# EAGLE design motor+line (EAGLE 9.5.1)
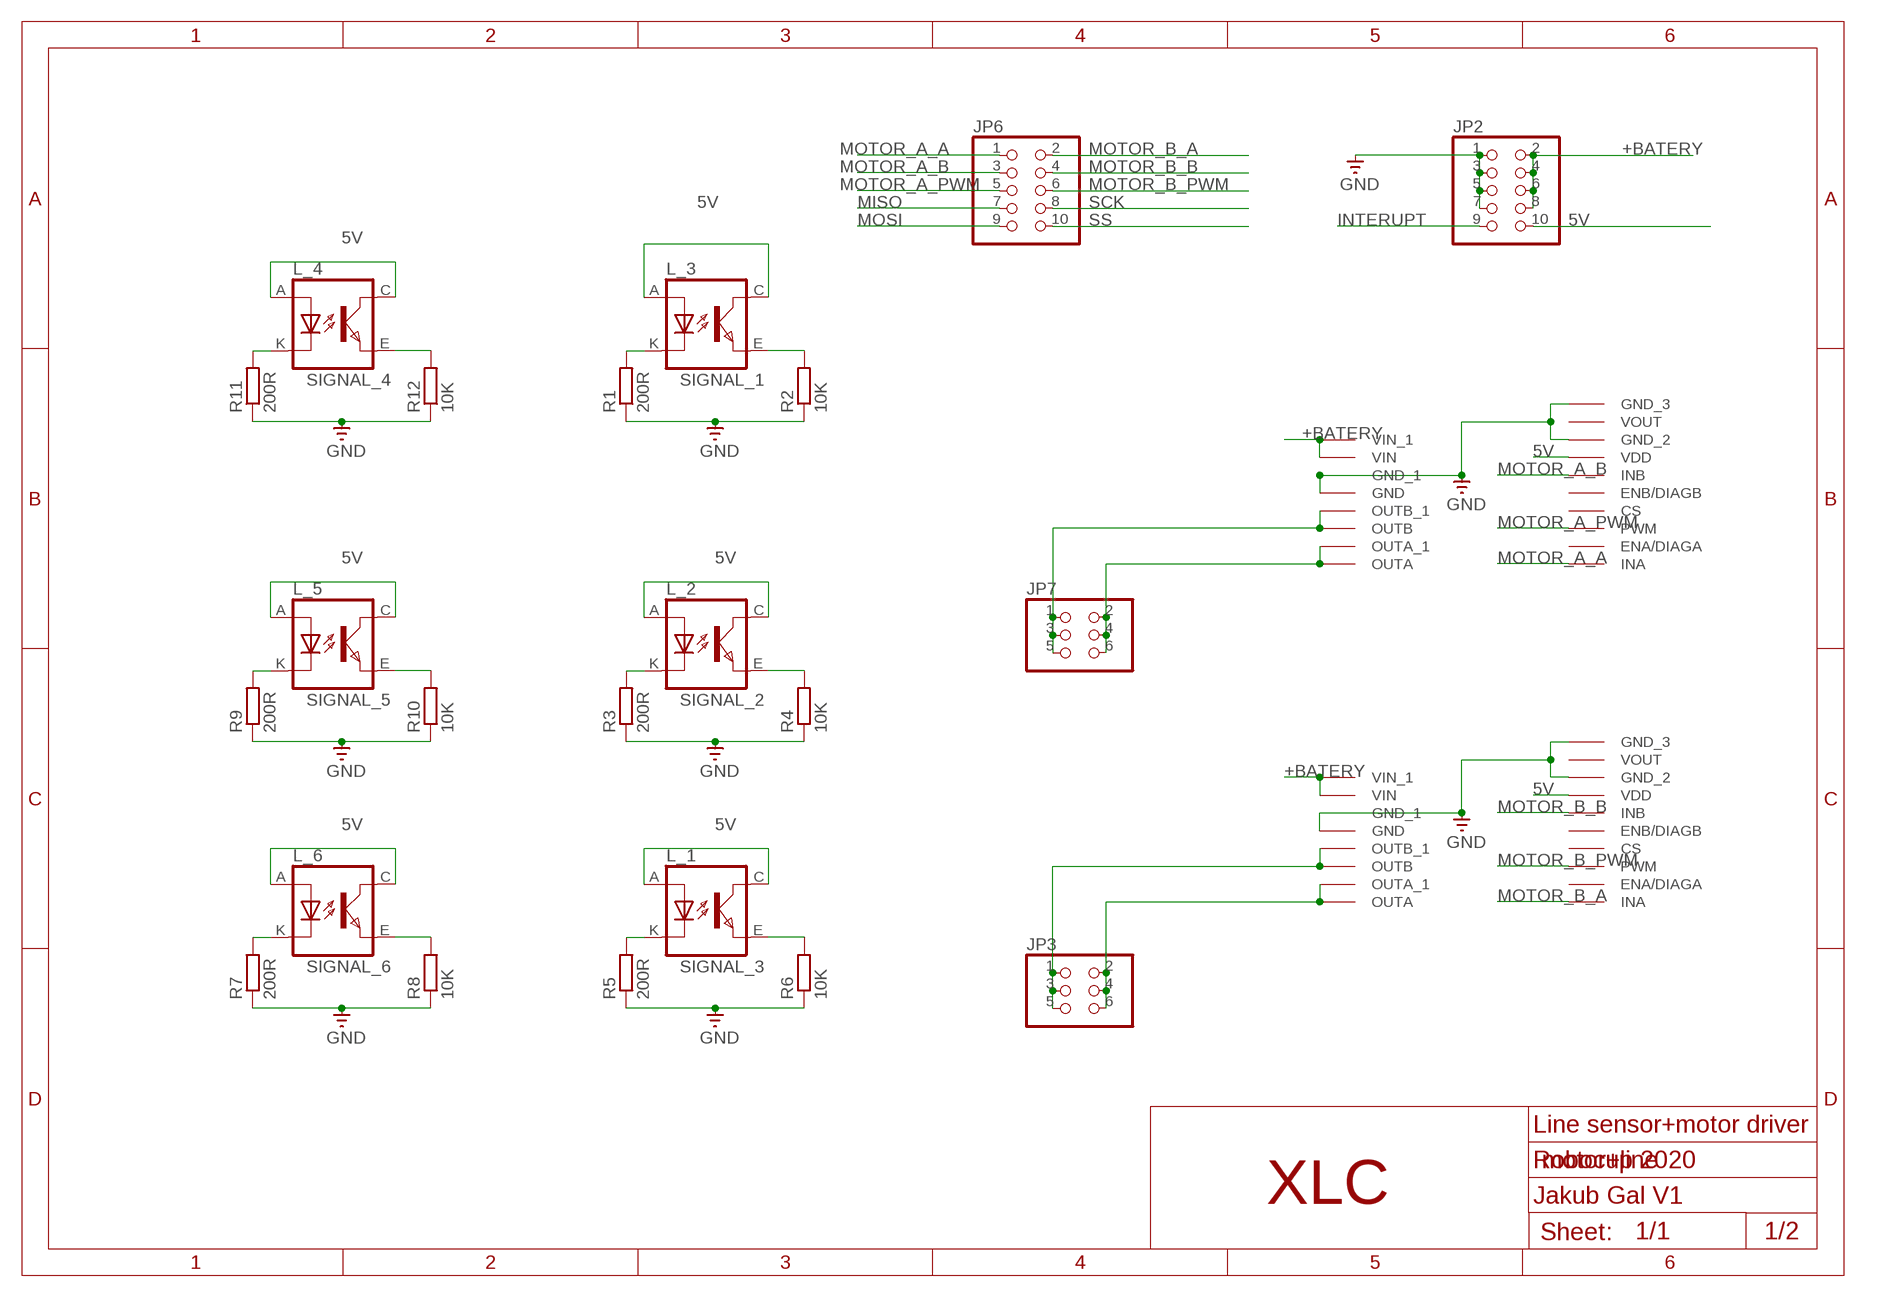
[diagram p0: schematic, sheet 1, part 1 of 2]
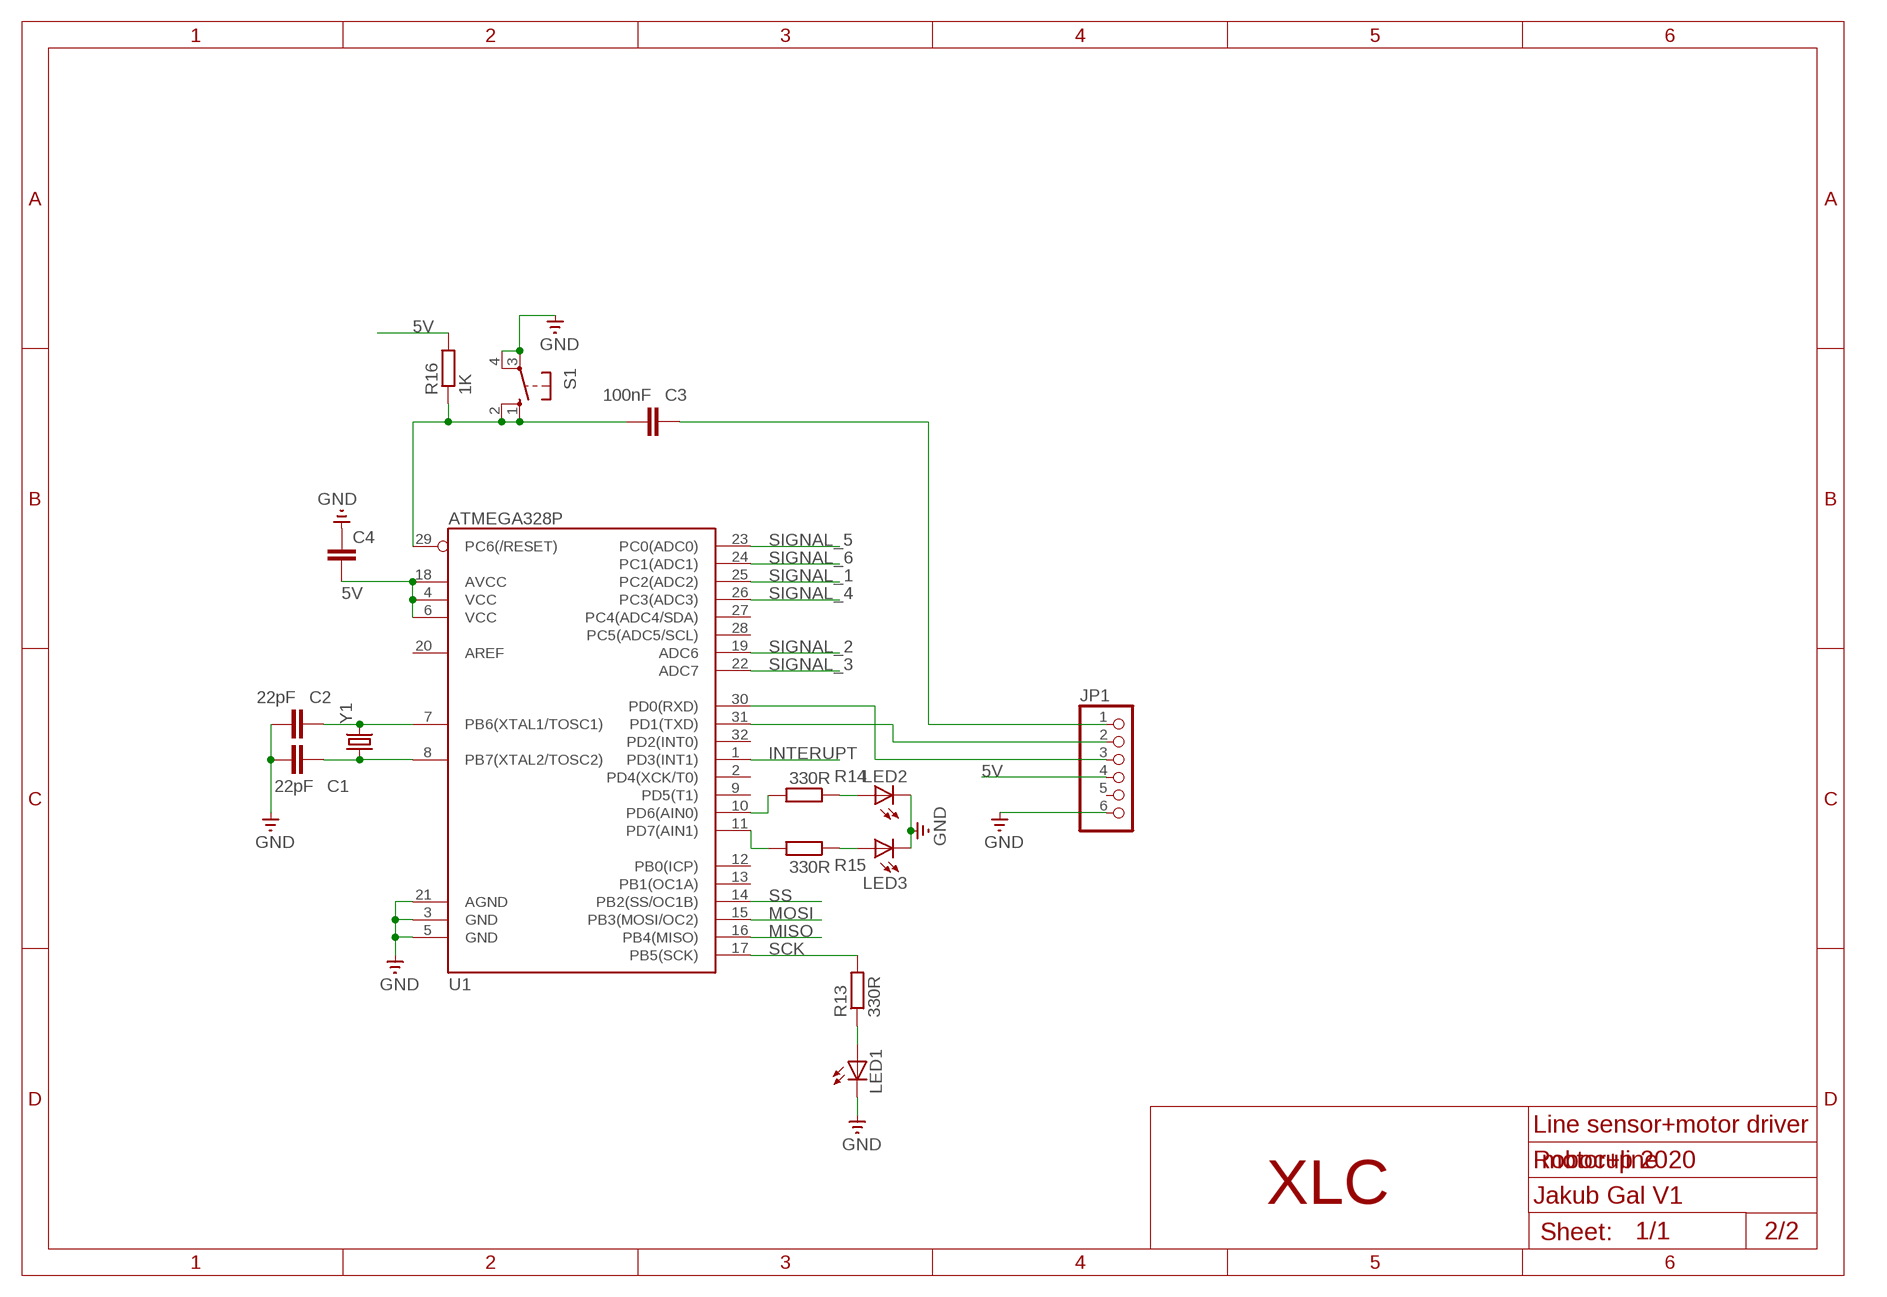
[diagram p1: schematic, sheet 1, part 2 of 2]

## Parts
C1  22pF  C-EUC0603  [C0603]
C2  22pF  C-EUC0603  [C0603]
C3  100nF  C-EUC0603  [C0603]
C4  C-EUC0603  [C0603]
JP1  PINHD-1X6/90  [1X06/90]
JP2  PINHD-2X5IDC  [2X05_IDC]
JP3  PINHD-2X3IDC  [2X03_IDC]
JP6  PINHD-2X5IDC  [2X05_IDC]
JP7  PINHD-2X3IDC  [2X03_IDC]
L_1  TCRT5000  [TCRT5000]
L_2  TCRT5000  [TCRT5000]
L_3  TCRT5000  [TCRT5000]
L_4  TCRT5000  [TCRT5000]
L_5  TCRT5000  [TCRT5000]
L_6  TCRT5000  [TCRT5000]
LED1  LEDCHIPLED_0603  [CHIPLED_0603]
LED2  LEDCHIPLED_0603  [CHIPLED_0603]
LED3  LEDCHIPLED_0603  [CHIPLED_0603]
R1  200R  R-EU_R0603  [R0603]
R2  10K  R-EU_R0603  [R0603]
R3  200R  R-EU_R0603  [R0603]
R4  10K  R-EU_R0603  [R0603]
R5  200R  R-EU_R0603  [R0603]
R6  10K  R-EU_R0603  [R0603]
R7  200R  R-EU_R0603  [R0603]
R8  10K  R-EU_R0603  [R0603]
R9  200R  R-EU_R0603  [R0603]
R10  10K  R-EU_R0603  [R0603]
R11  200R  R-EU_R0603  [R0603]
R12  10K  R-EU_R0603  [R0603]
R13  330R  R-EU_R0603  [R0603]
R14  330R  R-EU_R0603  [R0603]
R15  330R  R-EU_R0603  [R0603]
R16  1K  R-EU_R0603  [R0603]
S1  10-XX  [B3F-10XX]
U1  ATMEGA328P  ATMEGA328_SMT  [TQFP32-08]
U$1  MOTOR_DRIVER  [MOTOR_DRIVER]
U$2  MOTOR_DRIVER  [MOTOR_DRIVER]
Y1  CRYSTALHC49US  [HC49US]

## Nets
5V: C4.2 JP1.4 JP2.10 L_1.A(ANODE) L_1.C(COLLECTOR) L_2.A(ANODE) L_2.C(COLLECTOR) L_3.A(ANODE) L_3.C(COLLECTOR) L_4.A(ANODE) L_4.C(COLLECTOR) L_5.A(ANODE) L_5.C(COLLECTOR) L_6.A(ANODE) L_6.C(COLLECTOR) R16.2 U1.4(VCC) U1.6(VCC) U1.18(AVCC) U$1.VDD U$2.VDD
+BATERY: JP2.2 JP2.4 JP2.6 JP2.8 U$1.VIN U$1.VIN_1 U$2.VIN U$2.VIN_1
GND: C1.1 C2.1 C4.1 JP1.6 JP2.1 JP2.3 JP2.5 JP2.7 LED1.C LED2.C LED3.C R1.1 R2.1 R3.1 R4.1 R5.1 R6.1 R7.1 R8.1 R9.1 R10.1 R11.1 R12.1 S1.3(P) S1.4(P1) U1.3(GND) U1.5(GND) U1.21(AGND) U$1.GND U$1.GND_1 U$1.GND_2 U$1.GND_3 U$2.GND U$2.GND_1 U$2.GND_2 U$2.GND_3
INTERUPT: JP2.9 U1.1(PD3(INT1))
MISO: JP6.7 U1.16(PB4(MISO))
MOSI: JP6.9 U1.15(PB3(MOSI/OC2))
MOTOR_1_1: JP7.1 JP7.3 JP7.5 U$1.OUTB U$1.OUTB_1
MOTOR_1_2: JP7.2 JP7.4 JP7.6 U$1.OUTA U$1.OUTA_1
MOTOR_2_1: JP3.2 JP3.4 JP3.6 U$2.OUTA U$2.OUTA_1
MOTOR_2_2: JP3.1 JP3.3 JP3.5 U$2.OUTB U$2.OUTB_1
MOTOR_A_A: JP6.1 U$1.INA
MOTOR_A_B: JP6.3 U$1.INB
MOTOR_A_PWM: JP6.5 U$1.PWM
MOTOR_B_A: JP6.2 U$2.INA
MOTOR_B_B: JP6.4 U$2.INB
MOTOR_B_PWM: JP6.6 U$2.PWM
N$1: L_3.K(CATHODE) R1.2
N$2: L_2.K(CATHODE) R3.2
N$3: L_1.K(CATHODE) R5.2
N$4: L_6.K(CATHODE) R7.2
N$5: L_5.K(CATHODE) R9.2
N$6: L_4.K(CATHODE) R11.2
N$7: C2.2 U1.7(PB6(XTAL1/TOSC1)) Y1.2
N$8: C1.2 U1.8(PB7(XTAL2/TOSC2)) Y1.1
N$13: JP1.3 U1.30(PD0(RXD))
N$14: JP1.2 U1.31(PD1(TXD))
N$15: C3.2 JP1.1
N$16: C3.1 R16.1 S1.1(S) S1.2(S1) U1.29(PC6(/RESET))
N$17: LED1.A R13.1
N$19: LED2.A R14.1
N$20: R15.2 U1.11(PD7(AIN1))
N$21: LED3.A R15.1
N$22: R14.2 U1.10(PD6(AIN0))
SCK: JP6.8 R13.2 U1.17(PB5(SCK))
SIGNAL_1: L_3.E(EMITTER) R2.2 U1.25(PC2(ADC2))
SIGNAL_2: L_2.E(EMITTER) R4.2 U1.19(ADC6)
SIGNAL_3: L_1.E(EMITTER) R6.2 U1.22(ADC7)
SIGNAL_4: L_4.E(EMITTER) R12.2 U1.26(PC3(ADC3))
SIGNAL_5: L_5.E(EMITTER) R10.2 U1.23(PC0(ADC0))
SIGNAL_6: L_6.E(EMITTER) R8.2 U1.24(PC1(ADC1))
SS: JP6.10 U1.14(PB2(SS/OC1B))
Unconnected: JP1.5 U1.2(PD4(XCK/T0)) U1.9(PD5(T1)) U1.12(PB0(ICP)) U1.13(PB1(OC1A)) U1.20(AREF) U1.27(PC4(ADC4/SDA)) U1.28(PC5(ADC5/SCL)) U1.32(PD2(INT0)) U$1.CS U$1.ENA/DIAGA U$1.ENB/DIAGB U$1.VOUT U$2.CS U$2.ENA/DIAGA U$2.ENB/DIAGB U$2.VOUT

## Notes on the sheet
- Line sensor+motor driver | Line sensor+motor driver
- Robocup 2020 | Robocup 2020
- XLC | Jakub Gal V1 | XLC | Jakub Gal V1
- 1/2 | 2/2

## Library data of the parts
C1-C3 = rcl:C-EU: CAPACITOR, European symbol
C4 = rcl:C-EU: CAPACITOR, European symbol; SPICEPREFIX: C
JP1 = SERVO:PINHD-1X6: PIN HEADER
JP2 JP6 = pinhead-1:PINHD-2X5: PIN HEADER
JP3 JP7 = pinhead-1:PINHD-2X3: PIN HEADER
L_1-L_3 L_5 = tcrt5000:TCRT5000
L_4 L_6 = tcrt5000:TCRT5000; SPICEPREFIX: O
LED1-LED3 = audio amplifier example:LED
R1-R16 = rcl:R-EU_: RESISTOR, European symbol; SPICEPREFIX: R
S1 = switch-omron:10-XX: OMRON SWITCH; MPN: B3F-1000; OC_FARNELL: 176432; OC_NEWARK: 36M3542
U1 = SparkFun-DigitalIC:ATMEGA328_SMT: 32-Pin Atmega328 part Commonly used on Arduino compatible boards Available in QFP and QFN packages TQFP is IC-09069 QFN is non-stock; PROD_ID: IC-09069
U$1 U$2 = Moja:MOTOR_DRIVER
Y1 = SparkFun-FreqCtrl:CRYSTAL: Various standard crystals. Proven footprints. Spark Fun Electronics SKU : COM-00534

## Board
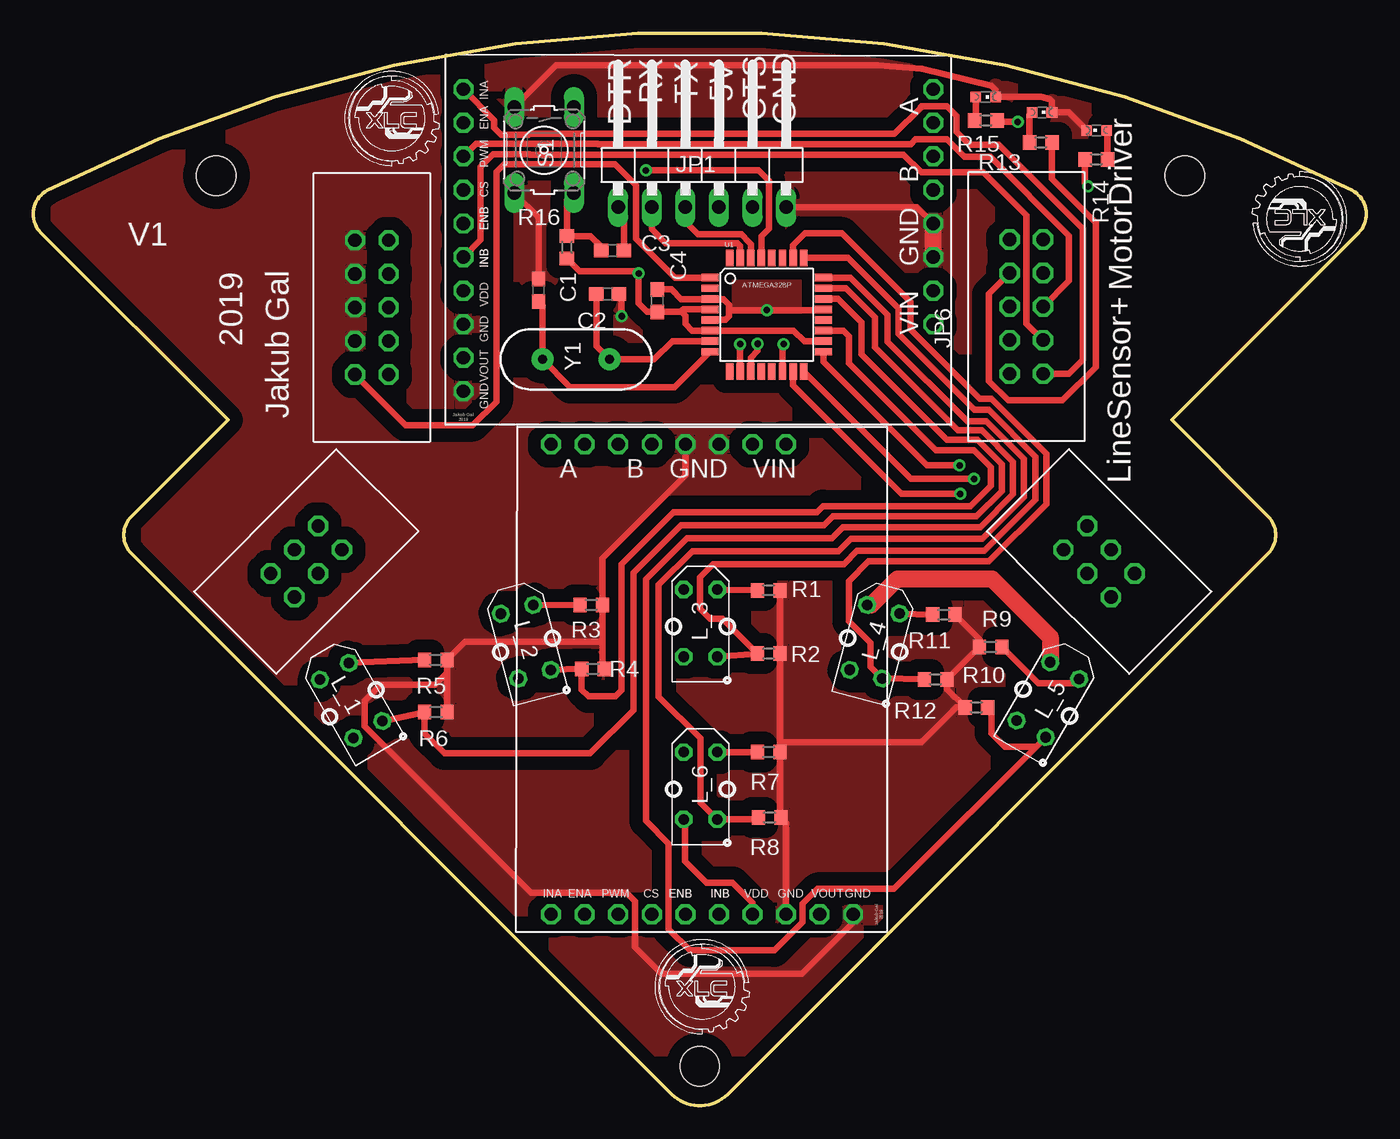
[diagram p2: board, top side]
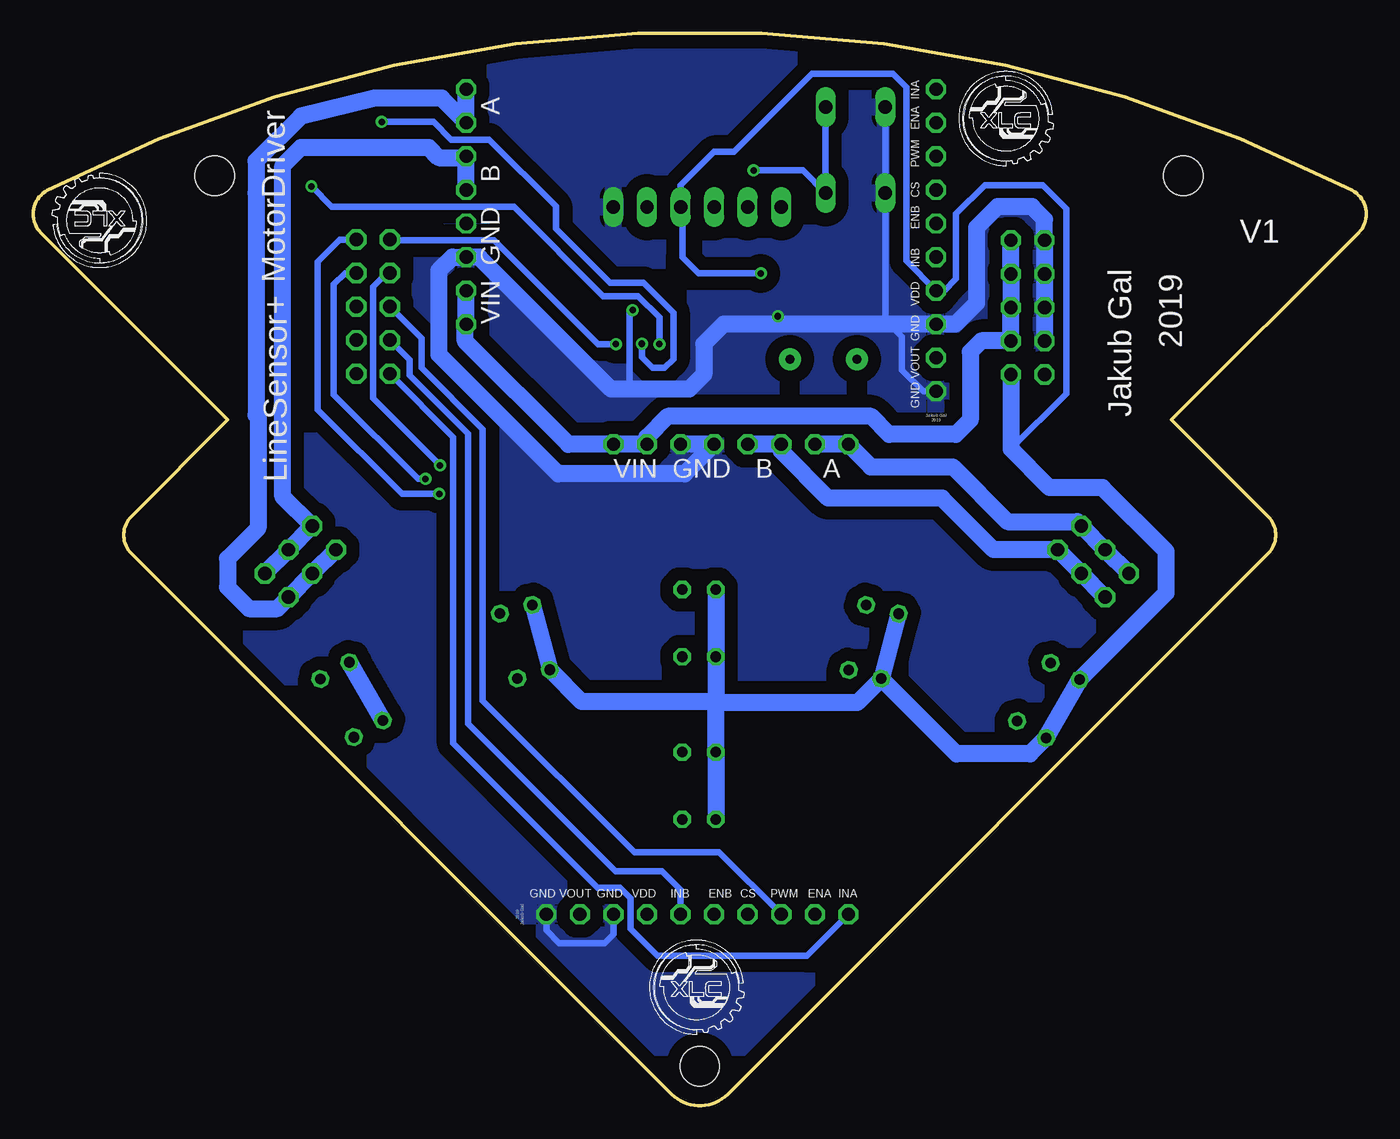
[diagram p3: board, bottom side, seen from below]

Size 100.92 x 81.15 mm. Coordinates in mm from the lower left corner, seen from the top.
Outline: 99.84,69.24 arc55 1.08,69.24 arc108 0.59,66.05 14.75,51.89 7.45,44.59 arc90 7.45,41.76 48.34,0.87 arc90 52.58,0.87 93.47,41.76 arc90 93.47,44.59 86.17,51.89 100.33,66.05 arc108 99.84,69.24
Copper layers (1*16): Top 0.035mm / dielectric 1.5mm / Bottom 0.035mm
Design rules "default": minimum track width 6mil, minimum drill 0.35mm, track to track 6mil, track to pad 6mil, pad to pad 6mil, via to via 6mil, smd to smd 6mil, copper to edge 40mil, drill to drill 6mil, minimum pad ring 10mil, minimum via ring 8mil, stop-mask expansion 4mil, vias tented up to drill 0mil, thermal gap 10mil
Holes 3 mm at 87.19,70.37 50.46,3 13.87,70.37

### Footprints (pad centres in the part's own frame; a part is rotated, then mirrored left to right if it is on the bottom)
C0603 = smd 1.1 x 1: 1 -0.85,0; 2 0.85,0
1X06/90 = drill 1.016 long: 1 -6.35,-3.81; 2 -3.81,-3.81; 3 -1.27,-3.81; 4 1.27,-3.81; 5 3.81,-3.81; 6 6.35,-3.81
2X05_IDC = drill 1.016 octagon: 1 -5.08,-1.27; 2 -5.08,1.27; 3 -2.54,-1.27; 4 -2.54,1.27; 5 0,-1.27; 6 0,1.27; 7 2.54,-1.27; 8 2.54,1.27; 9 5.08,-1.27; 10 5.08,1.27
2X03_IDC = drill 1.016 octagon: 1 -2.54,-1.27; 2 -2.54,1.27; 3 0,-1.27; 4 0,1.27; 5 2.54,-1.27; 6 2.54,1.27
TCRT5000 = drill 0.8 octagon: A -2.54,-1.27; C 2.54,-1.27; E 2.54,1.27; K -2.54,1.27
CHIPLED_0603 = smd 0.8 x 0.8: A 0,-0.75; C 0,0.75
R0603 = smd 1 x 1.1: 1 -0.85,0; 2 0.85,0
B3F-10XX = drill 1.016 long: 1 -3.251,2.261; 2 3.251,2.261; 3 -3.251,-2.261; 4 3.251,-2.261
TQFP32-08 = smd 1.27 x 0.559: 1 -4.293,2.8; 2 -4.293,2; 3 -4.293,1.2; 4 -4.293,0.4; 5 -4.293,-0.4; 6 -4.293,-1.2; 7 -4.293,-2; 8 -4.293,-2.8; 17 4.293,-2.8; 18 4.293,-2; 19 4.293,-1.2; 20 4.293,-0.4; 21 4.293,0.4; 22 4.293,1.2; 23 4.293,2; 24 4.293,2.8 | smd 0.559 x 1.27: 9 -2.8,-4.293; 10 -2,-4.293; 11 -1.2,-4.293; 12 -0.4,-4.293; 13 0.4,-4.293; 14 1.2,-4.293; 15 2,-4.293; 16 2.8,-4.293; 25 2.8,4.293; 26 2,4.293; 27 1.2,4.293; 28 0.4,4.293; 29 -0.4,4.293; 30 -1.2,4.293; 31 -2,4.293; 32 -2.8,4.293
MOTOR_DRIVER = drill 1 octagon: CS -2.54,-17.78; ENA/DIAGA -7.62,-17.78; ENB/DIAGB 0,-17.78; GND 0,17.78; GND_1 2.54,17.78; GND_2 7.62,-17.78; GND_3 12.7,-17.78; INA -10.16,-17.78; INB 2.54,-17.78; OUTA -10.16,17.78; OUTA_1 -7.62,17.78; OUTB -5.08,17.78; OUTB_1 -2.54,17.78; PWM -5.08,-17.78; VDD 5.08,-17.78; VIN 5.08,17.78; VIN_1 7.62,17.78; VOUT 10.16,-17.78
HC49US = drill 0.7 pad 1.651: 1 -2.54,0; 2 2.54,0

### Placement (x,y rotation side)
C1  38.25,61.71 270 top
C2  43.49,61.42 180 top
C3  43.86,64.7 0 top
C4  47.24,60.92 270 top
JP1  50.64,71.8 0 top
JP2  25.64,60.4 270 top
JP3  20.68,41.17 45 top
JP6  75.18,60.46 90 top
JP7  80.68,41.17 135 top
L_1  24.08,30.67 300 top
L_2  37.29,35.1 285 top
L_3  50.51,36.51 270 top
L_4  63.69,35.11 255 top
L_5  76.81,30.71 240 top
L_6  50.51,24.21 270 top
LED1  76.36,75.16 270 top
LED2  80.5,73.8 90 top
LED3  72.1,76.33 270 top
R1  55.67,39 180 top
R2  55.68,34.21 180 top
R3  42.25,37.89 180 top
R4  42.38,33.05 180 top
R5  30.48,33.73 180 top
R6  30.49,29.78 180 top
R7  55.68,26.75 180 top
R8  55.75,21.81 180 top
R9  72.47,34.72 0 top
R10  71.4,30.14 0 top
R11  68.93,37.15 180 top
R12  68.31,32.26 180 top
R13  76.27,72.89 0 top
R14  80.47,71.6 180 top
R15  72.12,74.55 0 top
R16  40.4,64.95 270 top
S1  38.68,72.3 270 top
U1  55.52,59.85 0 top
U$1  50.35,66.75 270 top
U$2  49.37,32.26 0 top
Y1  41.1,56.47 0 top

### Tracks (layer width: path | path; a pad name or v marks a point on that pad's centre or on a via)
5V  (via drill 0.5)
  Top 0.508: 49.06,60.07 C4.2 46.47,60.07 45.84,60.69 v45.84,62.98 45.68,63.14 41.36,63.14 R16.2 | U1.4 49.24,60.25 49.06,60.07 | 49.06,60.07 49.37,59.76 49.37,59.16 49.88,58.65 U1.6 57.57,58.65 58.37,57.85 U1.18 | L_6.C 49.33,21.58 49.33,18.49 50.96,16.86 52.94,16.86 54.45,15.35 U$2.VDD
  Top 1.27: L_4.A 63.45,37.89 65.42,39.86 72.58,39.86 76.98,35.45 L_5.A
  Bottom 0.508: 26.91,49.69 22.72,53.88 22.72,67.88 24.48,69.64 28.89,69.64 31.06,67.47 31.06,62.57 31.96,61.67 U$1.VDD 34.82,63.92 34.82,77.06 35.83,78.07 41.96,78.07 47.87,72.16 49.38,72.16 51.91,69.63 JP1.4 51.78,67.86 51.78,64.19 50.57,62.98 v45.84,62.98
  Bottom 1.27: L_2.A L_2.C | L_3.A L_3.C 49.24,30.5 | 49.24,30.5 L_6.A L_6.C | L_4.A L_4.C 59.4,30.58 49.32,30.58 49.24,30.5 | L_5.A L_5.C | L_2.C 31.03,26.63 25.45,26.63 L_1.C L_1.A 15.15,38.79 15.15,41.94 19.98,46.77 23.99,46.77 26.91,49.69 JP2.10 | L_2.C 38.54,30.5 49.24,30.5
+BATERY
  Bottom 1.27: U$1.VIN U$1.VIN_1 68.21,59.05 68.21,57.85 60.4,50.04 U$2.VIN_1 U$2.VIN 54.45,50.59 52.89,52.15 37.48,52.15 36.13,50.8 31.08,50.8 29.98,51.9 29.98,57.03 29.15,57.86 JP2.8 JP2.6 JP2.4 JP2.2
GND  (via drill 0.5)
  Top 0.508: R11.1 71.62,35.31 R9.1 R12.1 69.16,31.53 R10.1 69.89,30.14 67.24,27.49 56.53,27.49 | U$2.GND_2 56.99,21.42 R8.1 56.53,21.88 R7.1 56.53,27.49 | 31.34,32.76 R5.1 32.69,35.09 43.1,35.09 | 31.34,32.76 R6.1 | 43.1,35.09 R3.1 43.1,41.41 49.37,47.68 U$2.GND | 43.1,35.09 43.1,33.18 R4.1 | R1.1 R2.1 56.53,27.49 | C4.1 48.31,61.77 49.05,61.03 51.21,61.03 | 51.21,61.03 U1.3 | U1.5 52.41,59.45 52.68,59.72 52.68,60.2 | 52.68,60.2 52.68,60.59 52.24,61.03 51.21,61.03 | 52.68,60.2 v55.53,60.2 59.76,60.2 U1.21 | JP1.6 66.89,67.99 U$1.GND | LED2.C 78.39,75.16 LED1.C 77.11,76.01 76.95,76.16 76.28,76.33 LED3.C 72.85,76.87 72.54,77.18 67.28,78.46 63.91,78.73 39.6,78.73 S1.3 | 31.34,32.76 30.42,31.84 26.29,31.84 25.09,30.64 25.09,28.72 37.69,16.12 44.92,16.12 45.56,15.48 45.56,11.98 47.55,9.99 58.21,9.99 62.07,13.85 U$2.GND_3 | v44.54,59.73 44.54,61.21 C2.1 | C1.1 38.25,67.21 S1.4
  Top 1.27: U$1.GND_1 U$1.GND
  Bottom 0.508: U$1.GND_3 33.54,54.05 35.15,55.66 35.15,58.17 36.11,59.13 36.42,59.44 S1.4 S1.3 | U$2.GND_2 56.99,12.98 57.66,12.31 61.09,12.31 62.07,13.29 U$2.GND_3 | 48.66,59.13 48.58,59.21 44.64,59.21 44.54,59.3 v44.54,59.73 | 55.56,60.17 v55.53,60.2 55.6,60.2 55.79,60.01 55.79,54.54 55.47,54.22
  Bottom 1.27: U$2.GND_1 U$2.GND 51.6,47.81 61.17,47.81 70.19,56.83 70.19,63.2 69.18,64.21 U$1.GND_1 67.15,64.21 57.16,54.22 55.47,54.22 51.26,54.22 50.14,55.34 50.14,57.65 48.66,59.13 36.11,59.13 U$1.GND_2 31.12,59.13 29.52,60.73 29.52,66.43 27.93,68.02 25.32,68.02 24.37,67.07 JP2.1 JP2.3 JP2.5 JP2.7
  pour Top (isolate 1): 110,90 110,-10 -10,-10 -10,90
  pour Bottom (isolate 1): -10,90 -10,-10 110,-10 110,90
INTERUPT
  Top 0.508: JP2.9 28.2,51.49 33.28,51.49 35.07,53.28 35.07,70.66 35.64,71.24 44.05,71.24 45.63,69.66 45.63,65.61 48.59,62.65 U1.1
MISO  (via drill 0.5)
  Top 0.508: U1.16 66.46,47.42 v71.21,47.42 v71.22,47.43
  Bottom 0.508: v71.22,47.43 71.79,47.43 78.16,53.8 78.16,62.15 77.31,63 JP6.7
MOSI  (via drill 0.5)
  Top 0.508: U1.15 57.52,54.49 65.73,46.29 v70.18,46.29
  Bottom 0.508: JP6.9 77.72,65.53 79.38,63.87 79.38,52.67 73,46.29 v70.18,46.29
MOTOR_1_1
  Bottom 1.27: JP7.1 JP7.3 | JP7.3 | JP7.3 JP7.5 | JP7.5 | JP7.5 82.01,46.09 82.01,71.13 80.64,72.5 70.98,72.5 70.22,71.74 68.22,71.74 | 68.22,71.74 U$1.OUTB | U$1.OUTB_1 68.13,71.65 68.22,71.74
MOTOR_1_2
  Bottom 1.27: U$1.OUTA U$1.OUTA_1 69.99,76.23 75.06,76.23 80.64,74.87 84.03,71.48 84.03,69.06 84.04,69.06 84.04,52.28 83.88,52.12 83.88,43.7 86.19,41.39 86.19,39.23 84.58,37.62 82.43,37.62 JP7.2 JP7.4 | JP7.4 | JP7.6 JP7.4
MOTOR_2_1
  Bottom 1.27: U$2.OUTA_1 U$2.OUTA 37.51,48.34 31.3,48.34 27.16,44.2 21.91,44.2 JP3.6 JP3.4 | JP3.4 | JP3.4 | JP3.4 JP3.2
MOTOR_2_2
  Bottom 1.27: JP3.1 JP3.3 | JP3.3 | JP3.3 | JP3.3 JP3.5 28.23,42.06 32.13,45.97 40.74,45.97 44.29,49.52 U$2.OUTB U$2.OUTB_1
MOTOR_A_A
  Top 0.508: U$1.INA 34.91,74.57 34.91,73.99 35.42,73.48 37.52,73.48 37.56,73.52 65.2,73.52 67.18,75.5 67.18,75.57 67.24,75.63 69.17,75.63 69.9,74.9 69.9,73.68 70.86,72.72 73.09,72.72 79.44,66.37 79.44,56.43 78.39,55.38 JP6.1
MOTOR_A_B
  Top 0.508: JP6.3 75.19,59.18 75.19,67.36 71.93,70.62 67.22,70.62 65.88,71.96 37.6,71.96 37.56,72 34.83,72 33.89,71.06 33.89,65.53 U$1.INB
MOTOR_A_PWM
  Top 0.508: U$1.PWM 33.52,72.78 42.73,72.78 42.77,72.74 66.43,72.74 66.8,73.11 69.16,73.11 70.48,71.79 72.45,71.79 78.41,65.83 78.41,62.42 JP6.5
MOTOR_B_A
  Bottom 0.508: U$2.INA 42.34,11.35 53.65,11.35 55.71,13.41 55.71,15.7 56.51,16.5 58.2,16.5 69.11,27.41 69.11,50.58 JP6.2
MOTOR_B_B
  Bottom 0.508: U$2.INB 51.91,16.33 53.33,17.75 56.83,17.75 68,28.92 68,50.85 72.43,55.28 72.43,56.44 JP6.4
MOTOR_B_PWM
  Bottom 0.508: U$2.PWM 49,19.19 55.41,19.19 66.88,30.66 66.88,51.18 71.52,55.83 71.52,58.07 JP6.6
N$1
  Top 0.508: L_3.K R1.2
N$2
  Top 0.508: L_2.K R3.2
N$3
  Top 0.508: R5.2 L_1.K
N$4
  Top 0.508: L_6.K R7.2
N$5
  Top 0.508: R9.2 76.09,31.95 78.85,31.95 L_5.K
N$6
  Top 0.508: R11.2 L_4.K
N$7
  Top 0.508: C2.2 42.64,57.47 Y1.2 47.01,56.47 48.39,57.85 U1.7
N$8
  Top 0.508: U1.8 48.55,54.37 40.66,54.37 Y1.1 38.56,60.55 C1.2
N$13
  Top 0.508: JP1.3 49.37,66.87 50.32,65.92 53.6,65.92 54.18,65.34 54.18,65.33 54.32,65.19 U1.30
N$14
  Top 0.508: JP1.2 46.83,66.31 47.88,65.26 53.33,65.26 53.52,65.07 U1.31
N$15
  Top 0.508: C3.2 44.71,66.97 44.29,67.4 JP1.1
N$16  (via drill 0.5)
  Top 0.508: S1.2 40.4,68.5 R16.1 42.21,65.8 43.01,65 C3.1 | U1.29 55.12,65.77 55.69,66.34 55.69,68.28 55.68,68.29 55.68,69.97 54.89,70.76 v46.38,70.76
  Bottom 0.508: S1.1 S1.2 42.65,70.76 v46.38,70.76
N$17
  Top 0.508: R13.1 75.42,74.97 LED1.A
N$19
  Top 0.508: LED2.A 81.32,73.73 R14.1
N$20  (via drill 0.5)
  Top 0.508: R15.2 73.08,74.44 v74.53,74.44 | v54.84,57.65 54.84,57.13 54.32,56.61 U1.11
  Bottom 0.508: v74.53,74.44 70.61,74.44 69.26,73.09 66.4,73.09 61.35,68.04 61.35,66.35 57.26,62.26 54.71,62.26 52.46,60.01 52.46,56.48 53.11,55.83 54.03,55.83 54.84,56.64 v54.84,57.65
N$21
  Top 0.508: LED3.A 71.35,74.63 R15.1
N$22  (via drill 0.5)
  Top 0.508: R14.2 79.62,69.79 v79.85,69.56 | v53.51,57.62 v53.52,57.61 U1.10
  Bottom 0.508: v79.85,69.56 78.31,68.02 64.52,68.02 57.76,61.26 55.12,61.26 53.51,59.65 v53.51,57.62
SCK  (via drill 0.5)
  Top 0.508: R13.2 77.12,70.11 80.43,66.8 80.43,55.88 77.91,53.36 73.81,53.36 72.34,54.83 72.34,61.43 JP6.8 | v70.12,48.45 67.65,48.45 59.81,56.28 U1.17
  Bottom 0.508: v70.12,48.45 75.18,53.51 75.18,61.97 74.15,63 JP6.8
SIGNAL_1
  Top 0.508: L_3.E R2.2 52.18,36.86 51.22,36.86 50.48,37.6 50.48,39.99 51.47,40.98 61.36,40.98 62.37,41.98 72.01,41.98 75.86,45.84 75.86,49.12 72.33,52.65 71.25,52.65 65.49,58.4 65.49,60.33 61.69,64.14 U1.25
SIGNAL_2
  Top 0.508: L_2.E R4.2 41.53,31.49 42.04,30.98 44.09,30.98 44.55,31.44 44.55,40.98 48.49,44.92 59.32,44.92 59.77,45.37 70.95,45.37 72.48,46.89 72.48,48.32 71.21,49.59 68.34,49.59 61.76,56.17 61.76,58.22 61.33,58.65 U1.19
SIGNAL_3
  Top 0.508: L_1.E R6.2 29.64,28.16 31.13,26.67 42.17,26.67 45.44,29.94 45.44,40.32 49.04,43.92 59.87,43.92 60.54,44.59 71.41,44.59 73.33,46.5 73.33,48.53 71.48,50.38 69.17,50.38 62.69,56.85 62.69,59.26 60.91,61.05 U1.22
SIGNAL_4
  Top 0.508: R12.2 L_4.E 63.37,33.21 63.37,35.02 61.75,36.64 61.75,39.68 63.24,41.17 72.35,41.17 76.67,45.5 76.67,49.34 72.53,53.49 71.66,53.49 66.4,58.75 66.4,60.83 61.24,66 58.42,66 57.52,65.1 U1.26
SIGNAL_5
  Top 0.508: R10.2 72.52,29.87 72.52,28.19 73.54,27.17 75.93,27.17 L_5.E 65.16,16.4 59.37,16.4 58.25,15.28 58.25,13.9 56.1,11.75 49.71,11.75 48.11,13.35 48.11,19.83 46.38,21.56 46.38,39.83 49.48,42.93 60.45,42.93 61.3,43.78 71.69,43.78 74.16,46.25 74.16,48.74 71.81,51.09 70,51.09 63.71,57.37 63.71,59.67 61.53,61.85 U1.23
SIGNAL_6
  Top 0.508: R8.2 54.76,21.67 L_6.E 50.52,22.93 50.52,27.79 47.35,30.96 47.35,39.4 49.92,41.97 60.97,41.97 61.9,42.9 71.86,42.9 75.01,46.05 75.01,48.95 72.17,51.79 70.7,51.79 64.67,57.81 64.67,59.85 61.88,62.65 U1.24
SS  (via drill 0.5)
  Top 0.508: v56.81,57.62 56.72,57.53 U1.14
  Bottom 0.508: JP6.10 73.87,65.5 66.03,65.5 58.15,57.62 v56.81,57.62

### Text on the board
tNames: RX | TX | 5V | CTS | DTR | GND | V1 | 2019 | MotorDriver | Jakub Gal | LineSensor+
bNames: MotorDriver | V1 | 2019 | Jakub Gal | LineSensor+